# Altium project ESP32_1.PrjPcb
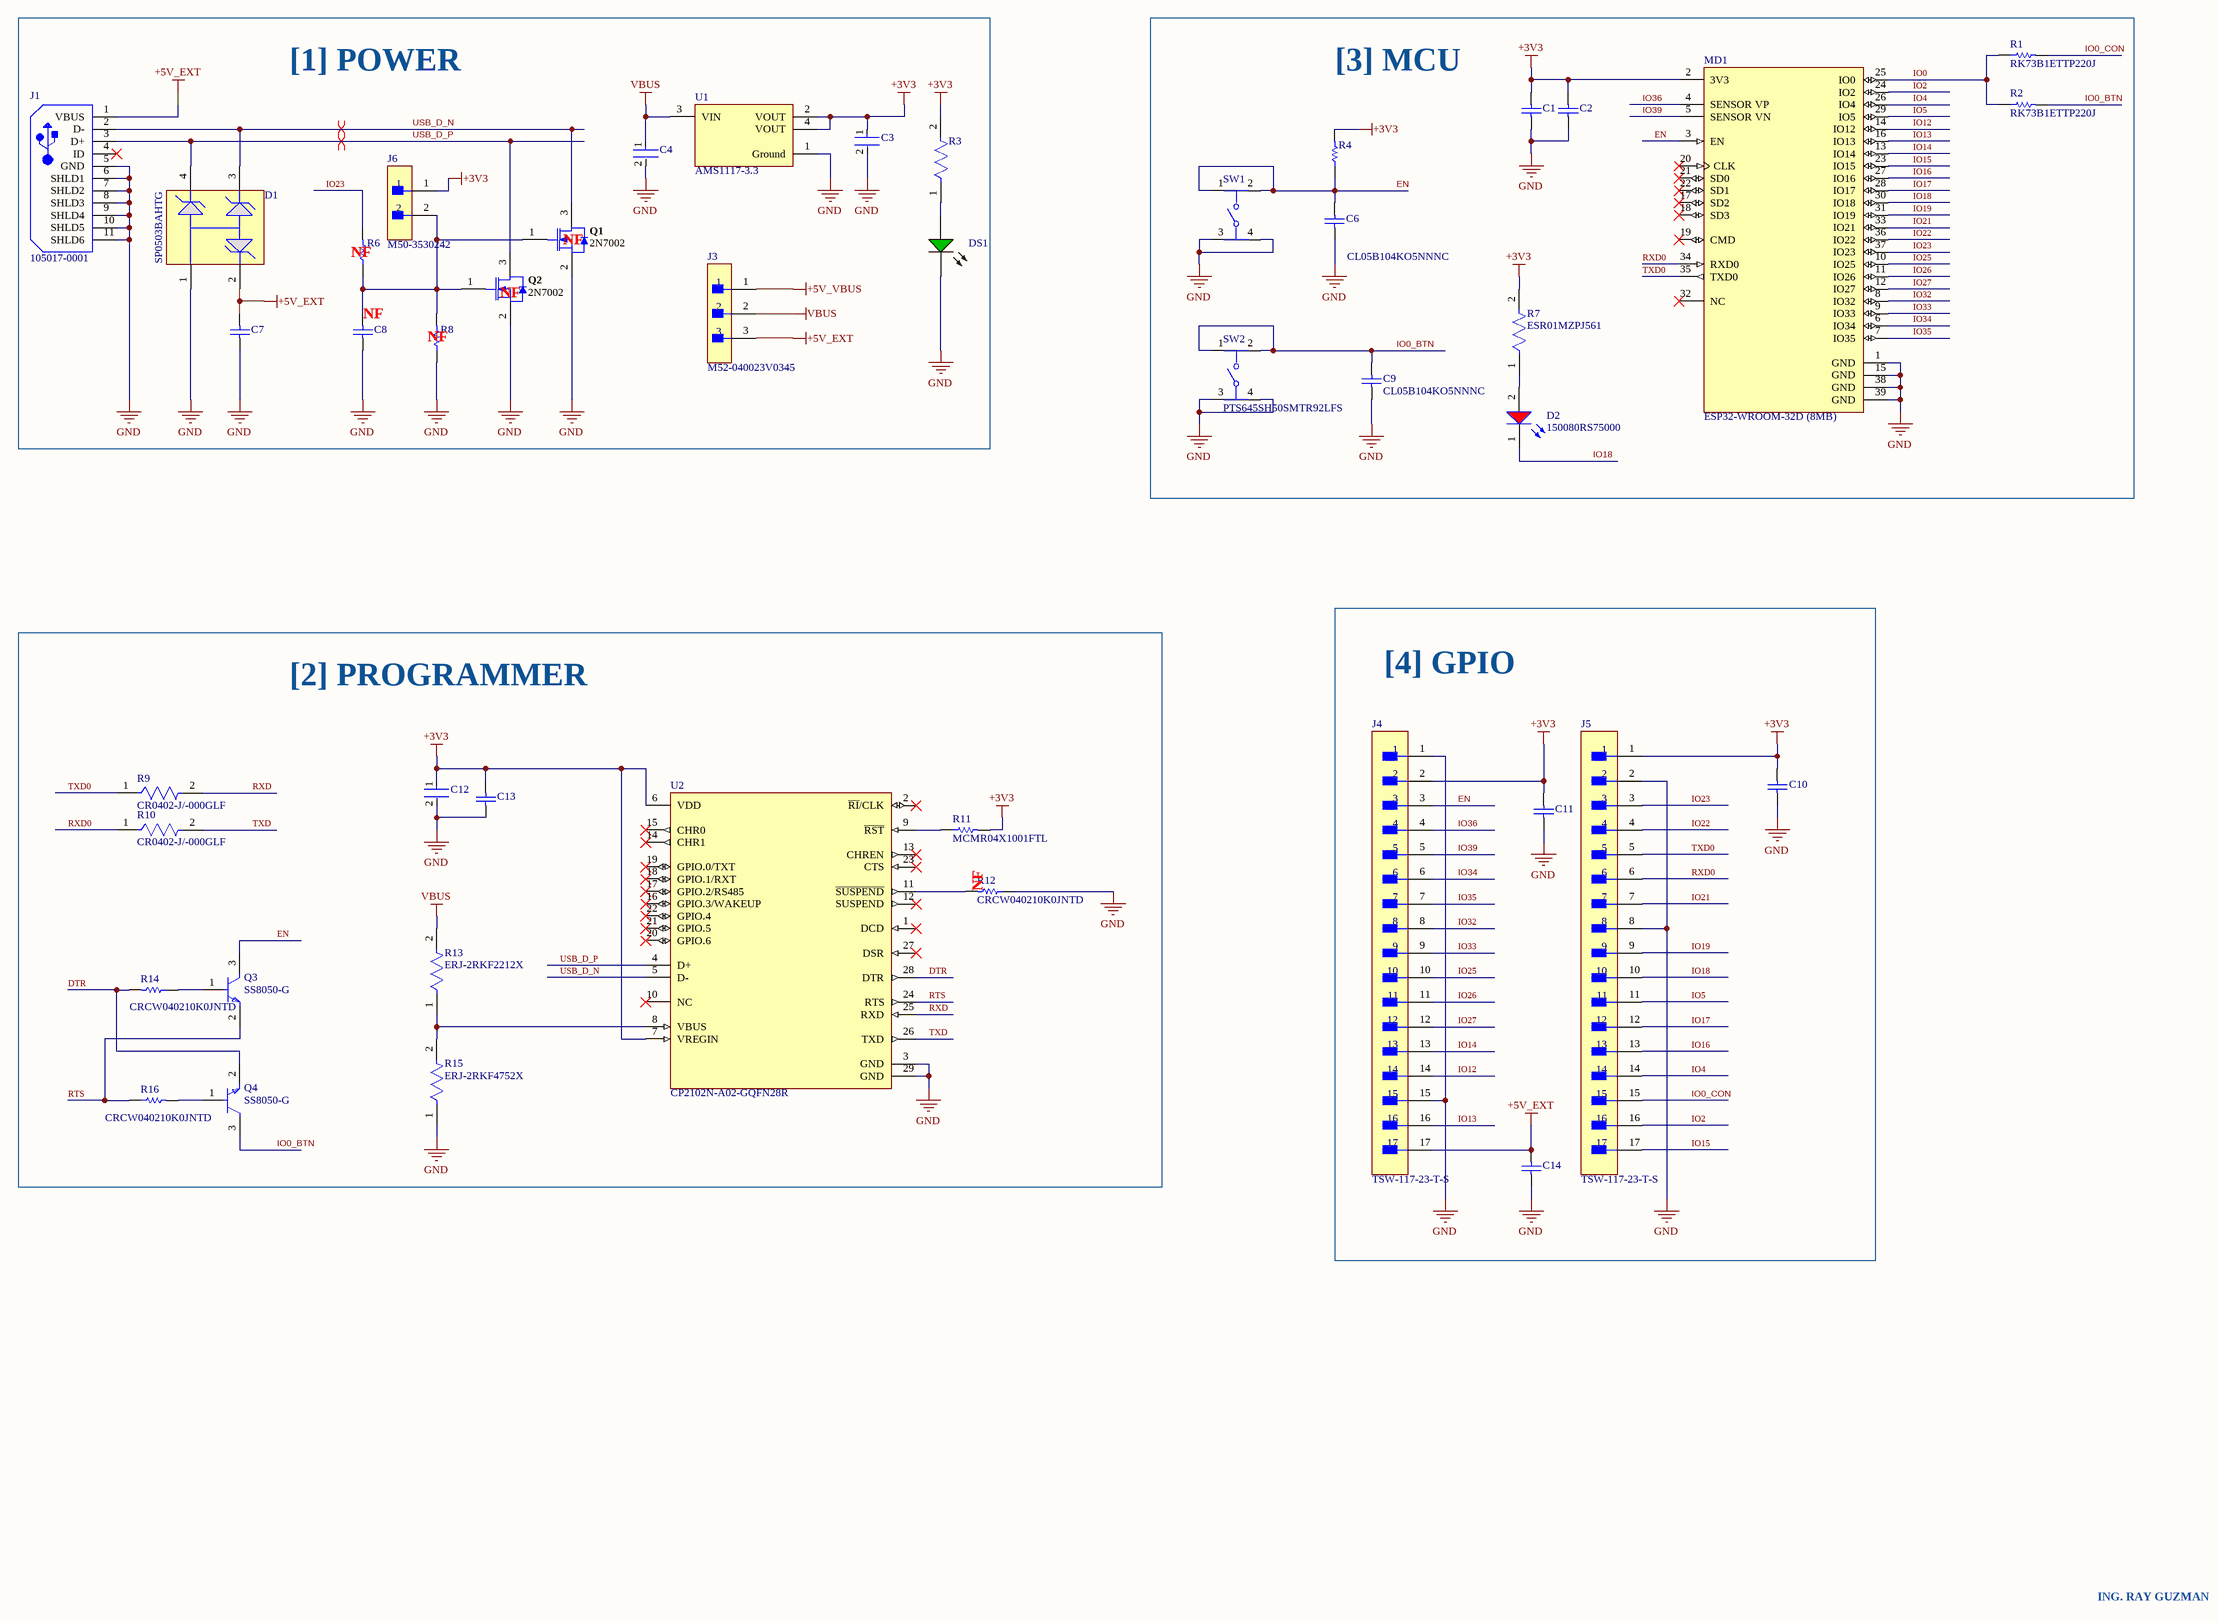
[diagram p0: ESP32_SCH.SchDoc]
1 sheet, 45 parts. Net scope: global (net labels, ports and power ports of the same name join across sheets).
Board file: ESP32_PCB.PcbDoc

## Sheet ESP32_SCH.SchDoc
size C; SheetNumber: 1; SheetTotal: 1

### Parts
C1  CL21A226MAQNNNE  [CAPC2013X140X45LL15T25]  (value not drawn)
C2  CL05B104KO5NNNC  [CAPC1050X55X23ML05T13]  (value not drawn)
C3  CL05A106MP5NUNC  [FP-CL05A106MP5NUNC-MFG]  (value not drawn)
C4  CL05A106MP5NUNC  [FP-CL05A106MP5NUNC-MFG]  (value not drawn)
C6  CL05B104KO5NNNC  [CAPC1050X55X23ML05T13]
C7  CL05B104KO5NNNC  [CAPC1050X55X23ML05T13]  (value not drawn)
C8  CL05B104KO5NNNC  [CAPC1050X55X23ML05T13]  (value not drawn)
C9  CL05B104KO5NNNC  [CAPC1050X55X23ML05T13]
C10  CL05B104KO5NNNC  [CAPC1050X55X23ML05T13]  (value not drawn)
C11  CL05B104KO5NNNC  [CAPC1050X55X23ML05T13]  (value not drawn)
C12  C1005X5R1A475K050BC  [FP-C1005-050-0_15-MFG]  (value not drawn)
C13  CL05B104KO5NNNC  [CAPC1050X55X23ML05T13]  (value not drawn)
C14  CL05B104KO5NNNC  [CAPC1050X55X23ML05T13]  (value not drawn)
D1  SP0503BAHTG  [LFUS-SOT143-4_V]
D2  150080RS75000  [WL-SMCW_0805_150080xx75000]
DS1  HSMG-C170  [AVAG-HSMX-C170_V]  (value not drawn)
J1  105017-0001  [USB-MICRO-B_V]
J3  M52-040023V0345  [FP-M52-040023V0345-MFG]
J4  TSW-117-23-T-S  [FP-TSW-117-23-T-S-MFG]
J5  TSW-117-23-T-S  [FP-TSW-117-23-T-S-MFG]
J6  M50-3530242  [FP-M50-3530242-MFG]
MD1  ESP32-WROOM-32D (8MB)  [FP-ESP32-WROOM-32D_8MB-MFG]
Q1  2N7002  [INF-PG-SOT23_M]
Q2  2N7002  [INF-PG-SOT23_M]
Q3  SS8050-G  [FP-SS8050-G-MFG]
Q4  SS8050-G  [FP-SS8050-G-MFG]
R1  RK73B1ETTP220J  [RESC1005X40X25ML10T10]
R2  RK73B1ETTP220J  [RESC1005X40X25ML10T10]
R3  PNM0402E5001BST1  [FP-PNM0402-IPC_C]  (value not drawn)
R4  CRCW040210K0JNTD  [RESC1005X40X25ML05T05]  (value not drawn)
R6  MCMR04X1001FTL  [RESC1005X40X25ML05T10]  (value not drawn)
R7  ESR01MZPJ561  [FP-ESR01-IPC_C]
R8  CRCW040210K0JNTD  [RESC1005X40X25ML05T05]  (value not drawn)
R9  CR0402-J/-000GLF  [FP-CR0402-IPC_B]
R10  CR0402-J/-000GLF  [FP-CR0402-IPC_B]
R11  MCMR04X1001FTL  [RESC1005X40X25ML05T10]
R12  CRCW040210K0JNTD  [RESC1005X40X25ML05T05]
R13  ERJ-2RKF2212X  [FP-ERJ2RK-IPC_C]
R14  CRCW040210K0JNTD  [RESC1005X40X25ML05T05]
R15  ERJ-2RKF4752X  [FP-ERJ2RK-IPC_A]
R16  CRCW040210K0JNTD  [RESC1005X40X25ML05T05]
SW1  PTS645SH50SMTR92LFS  [FP-PTS645SH50SMTR92LFS-MFG]  (value not drawn)
SW2  PTS645SH50SMTR92LFS  [FP-PTS645SH50SMTR92LFS-MFG]
U1  AMS1117-3.3  [FP-AMS1117-IPC_C]
U2  CP2102N-A02-GQFN28R  [FP-CP2102N-A02-GQFN28R-MFG]

### Blocks framed on the sheet
[1] POWER: C3 C4 C7 C8 D1 DS1 J1 J3 J6 Q1 Q2 R3 R6 R8 U1
[3] MCU: C1 C2 C6 C9 D2 MD1 R1 R2 R4 R7 SW1 SW2
[4] GPIO: C10 C11 C14 J4 J5
[2] PROGRAMMER: C12 C13 Q3 Q4 R9-R16 U2

### Nets
+3V3: C1.1 C2.1 C3.1 C10.1 C11.1 C12.1 C13.1 J4.2 J5.1 J6.1 MD1.2(3V3) R3.2 R4.2 R7.2 R11.2 U1.2(VOUT) U1.4(VOUT) U2.6(VDD) U2.7(VREGIN)
+5V_EXT: C7.1 C14.1 D1.2 J1.1(VBUS) J3.3 J4.17
+5V_VBUS: J3.1
GND: C1.2 C2.2 C3.2 C4.2 C6.1 C7.2 C8.1 C9.1 C10.2 C11.2 C12.2 C13.2 C14.2 D1.1 DS1.2(K) J1.5(GND) J1.6(SHLD1) J1.7(SHLD2) J1.8(SHLD3) J1.9(SHLD4) J1.10(SHLD5) J1.11(SHLD6) J4.1 J4.15 J5.2 J5.8 MD1.1(GND) MD1.15(GND) MD1.38(GND) MD1.39(GND) Q1.2(SOURCE) Q2.2(SOURCE) R8.1 R12.1 R15.1 SW1.3 SW1.4 SW2.3 SW2.4 U1.1(Ground) U2.3(GND) U2.29(GND)
VBUS: C4.1 J3.2 R13.2 U1.3(VIN)
DTR: Q4.2(E) R14.2 U2.28(DTR)
EN: C6.2 J4.3 MD1.3(EN) Q3.3(C) R4.1 SW1.1 SW1.2
IO0: MD1.25(IO0) R1.1 R2.1
IO0_BTN: C9.2 Q4.3(C) R2.2 SW2.1 SW2.2
IO0_CON: J5.15 R1.2
IO2: J5.16 MD1.24(IO2)
IO4: J5.14 MD1.26(IO4)
IO5: J5.11 MD1.29(IO5)
IO12: J4.14 MD1.14(IO12)
IO13: J4.16 MD1.16(IO13)
IO14: J4.13 MD1.13(IO14)
IO15: J5.17 MD1.23(IO15)
IO16: J5.13 MD1.27(IO16)
IO17: J5.12 MD1.28(IO17)
IO18: D2.1(K) J5.10 MD1.30(IO18)
IO19: J5.9 MD1.31(IO19)
IO21: J5.7 MD1.33(IO21)
IO22: J5.4 MD1.36(IO22)
IO23: J5.3 MD1.37(IO23) R6.2
IO25: J4.10 MD1.10(IO25)
IO26: J4.11 MD1.11(IO26)
IO27: J4.12 MD1.12(IO27)
IO32: J4.8 MD1.8(IO32)
IO33: J4.9 MD1.9(IO33)
IO34: J4.6 MD1.6(IO34)
IO35: J4.7 MD1.7(IO35)
IO36: J4.4 MD1.4(SENSOR_VP)
IO39: J4.5 MD1.5(SENSOR_VN)
RTS: Q3.2(E) R16.1 U2.24(RTS)
RXD: R9.2 U2.25(RXD)
RXD0: J5.6 MD1.34(RXD0) R10.1
TXD: R10.2 U2.26(TXD)
TXD0: J5.5 MD1.35(TXD0) R9.1
USB_D_N: D1.3 J1.2(D-) Q1.3(DRAIN) U2.5(D-)
USB_D_P: D1.4 J1.3(D+) Q2.3(DRAIN) U2.4(D+)
NetC8_2: C8.2 J6.2 Q1.1(GATE) Q2.1(GATE) R6.1 R8.2
NetD2_2: D2.2(A) R7.1
NetDS1_1: DS1.1(A) R3.1
NetQ3_1: Q3.1(B) R14.1
NetQ4_1: Q4.1(B) R16.2
NetR11_1: R11.1 U2.9(~{RST})
NetR12_2: R12.2 U2.11(~{SUSPEND})
NetR13_1: R13.1 R15.2 U2.8(VBUS)

Not connected (* = marked no-connect by the designer): J1 4(ID)*; MD1 17(SD2)* 18(SD3)* 19(CMD)* 20(CLK)* 21(SD0)* 22(SD1)* 32(NC)*; U2 1(DCD)* 2(~{RI}/CLK)* 10(NC)* 12(SUSPEND)* 13(CHREN)* 14(CHR1)* 15(CHR0)* 16(GPIO.3/WAKEUP)* 17(GPIO.2/RS485)* 18(GPIO.1/RXT)* 19(GPIO.0/TXT)* 20(GPIO.6)* 21(GPIO.5)* 22(GPIO.4)* 23(CTS)* 27(DSR)*

### Layout directives
differential pair; differential pair class USB_D: USB_D_N, USB_D_P

### Notes on the sheet
- (near R6) NF
- (near J6) NF
- (near Q1) NF
- (near C8) NF
- (near Q2) NF
- (near R8) NF
- (near R12) NF
- ING. RAY GUZMAN

### Library data of the parts
C1 = CMP-2000-06104-1: Multi-layer Ceramic Capacitor, 22 uF, -55 to 85 degC, 2-Pin SMD (0805), RoHS, Tape and Reel; Manufacturer: Samsung Electro-Mechanics; Voltage - Rated: 25V; Other Names: 1276-2908-2; Capacitance: 22µF; Featured Product: Multi-LayerCeramicCapacitors; Product Training Modules: HighCapMLCCFamily; Temperature Coefficient: X5R; Tolerance: ±20%; Online Catalog: CLSeries,HighCapacitance; Applications: GeneralPurpose; RoHS Information: MLCCRoHS2Compliance; Height - Seated (Max): -; Lead Style: -; Lead Spacing: -; Datasheet URL: http://datasheet.octopart.com/CL21A226MAQNNNE-Samsung-datasheet-48647558.pdf; Size / Dimension: 0.079"Lx0.049"W(2.00mmx1.25mm); Thickness (Max): 0.055"(1.40mm); Family: CeramicCapacitors; Package Description: 2-Pin Surface Mount Device, Body 2.0 x 1.25 mm; Datasheet Version: 07/2015; Packaging: Tape&Reel(TR); Manufacturer URL: http://www.samsungsem.com/global/index.jsp; Ratings: -; Package / Case: 0805(2012Metric); Standard Package: 2,000; Mounting Type: SurfaceMount,MLCC; Mounting Technology: SurfaceMount; Category: Capacitors; Package Reference: 0805; Series: CL; Features: -; Operating Temperature: -55°C~85°C
C2 C6-C11 C13 C14 = CMP-2000-05439-1: Chip Capacitor, 100 nF, +/- 10%, 16 V, -55 to 125 degC, 0402 (1005 Metric), RoHS, Tape and Reel; Manufacturer: Samsung Electro-Mechanics; Capacitance: 100000pF; Dielectric: X7R; Rated Voltage: 16V; Case Size/Dimension: 0402; Tolerance (%): ±10%; Manufacturer URL: http://www.samsungsem.com/global/index.jsp; Datasheet URL: https://datasheet.ciiva.com/29198/458718-da-01-en-vs-kondensator-0402-29198423.pdf; Datasheet Version: Nov-10
C3 C4 = CMP-13271-000002-1: CAP CER 10UF 10V X5R 0402; Manufacturer: Samsung; Temperature Coefficient: 15%; Tolerance: 20%; Material: Ceramic; Octopart: https://octopart.com/cl05a106mp5nunc-samsung-22457395; Voltage Rating: 10V; RoHS: TRUE; Value: 10uF; Height: 0.7mm; Digikey Description: CAP CER 10UF 10V X5R 0402; Automotive: No; Package: CL05A106MP5NUNC; Device Class L1: Passive Components; Capacitance: 10uF; Temperature Range High: +85°C; ComponentLink2Description: Datasheet; Device Class L2: Capacitors; Temperature Characteristic: X5R; Manufacturer Part Number: CL05A106MP5NUNC; Temperature: -55°C to +85°C; ComponentLink2URL: http://www.samsungsem.com/kr/support/product-search/mlcc/__icsFiles/afieldfile/2019/05/10/19-CL05A106MP5NUNC.pdf; Device Class L3: Ceramic Capacitors; Category: Cap; Temperature Range Low: -55°C; Ipc Land Pattern Name: CAPC10050X50; Lead Free: Yes
C12 = CMP-2000-05997-2: CAP CER 4.7UF 10V X5R 0402; Dielectric Material: Ceramic; Tolerance: 10%; Series: C; Package Quantity: 10000; Max Operating Temperature: 85°C; Case Code (Imperial): 0402; Lead Free: Lead Free; Voltage Rating (DC): 10V; Packaging: Cut Tape; Voltage Rating: 10V; Min Operating Temperature: -55°C; Dielectric: X5R; Thickness: 0.022inch; Width: 0.02inch; Case/Package: 0402; Case Code (Metric): 1005; Capacitance: 4.7uF; Length: 0.039inch; RoHS Compliant: Yes; REACH SVHC: No SVHC; Mount: Surface Mount
D1 = CMP-2000-05191-1: TVS Diode Array, 30 pF, 30 KV, -40 to 85 degC, 4-Pin SOT143, RoHS, Tape and Reel; Manufacturer: Littelfuse; Direction Type: Uni-Directional; Product Height (mm): 1.05mm; Leakage Current (Max): 0.1uA; Clamping Voltage (Max): 8V; Reverse Stand-off Voltage: 5.5(Min)V; Configuration: Triple; Working Voltage: 5.5V; Product Length (mm): 3.04mm; Working Voltage (Max): 5.5V(Min); Capacitance Value: 30pF; Rad Hardened: No; Number of Elements: 3; Product Depth (mm): 1.4mm; Operating Temperature Max Deg. C: 85C; Suppressor Type: TVS; Operating Temperature Min Deg. C: -40C; Operating Temp Range: -40Cto85C; Mounting: SurfaceMount; Package / Case: SOT-143; Datasheet Version: Dec-13; Package Type: SOT-143; Packaging: TapeandReel; Pin Count: 3+Tab; Operating Temperature Classification: Industrial; Datasheet URL: https://datasheet.ciiva.com/15143/getdatasheetpartid-116020-15143550.pdf; Manufacturer URL: http://www.littelfuse.com/; Leakage Current: 0.1uA; Mounting Style: SurfaceMount; Clamping Voltage: 8V; Polarity: Uni-Directional
D2 = CMP-1426-00011-2: NexarPartId: 29717781; Peak Wavelength: 630nm; Wavelength: 625nm; Viewing Angle: 140°; Test Current: 20mA; Forward Voltage: 2V; Forward Current: 100mA; Lens Style: Clear, Rectangular; Color: Red; Luminous Intensity: 150mcd; Max Reverse Voltage (DC): 5V; Length: 2mm; Case Code (Imperial): 0805; RoHS: Compliant; Max Operating Temperature: 85°C; Height: 700µm; Packaging: Tape and Reel; Case/Package: 0805; REACH SVHC: Unknown; Dominant Wavelength: 625nm; Min Operating Temperature: -40°C; Case Code (Metric): 2012; Mount: Surface Mount; Width: 1.25mm
DS1 = CMP-2000-05062-1: Chip LED, Green, 2.2 V, -40 to 85 degC, 2-Pin SMD, Pb-Free, Tape and Reel; Manufacturer: Avago; No. of Pins: 2; Peak Wavelength: 570nm; SVHC: NoSVHC(16-Jun-2014); Dominant Wavelength: 572nm; Forward Current If: 20mA; Viewing Angle: 170deg; Lens Shape: Rectangular; PIV Max: 5V; External Width: 1.25mm; LED Type: Standard; External Depth: 0.8mm; Opto Mounting Orientation: Top; Luminous Intensity: 15mcd; Luminous Intensity Min: 4mcd; Forward Voltage VF Max: 2.6V; External Length / Height: 2mm; Bulb Size: 1.25mmx1.4mm; Light Area Height: 1mm; Voltage Vf Typ: 2.2V; Operating Temperature Max: 85degC; Datasheet Version: Oct-08; MSL: MSL2A-4weeks; Peak Forward Current: 20mA; Package Description: 2-Pin Surface Mount Device, Body 2 x 1.25 mm, Height 0.8 mm; Datasheet URL: https://datasheet.ciiva.com/29280/180495-da-01-en-chip-led-hsmg-c170-gelb-gruen-29280971.pdf; Storage Temperature Min: -40degC; LED Colour: Green; Wavelength Typ: 570nm; Mounting Type: SMD; Forward Current If Max: 20mA; Dominant Wavelength Typ: 572nm; LED Mounting: SMD; Operating Temperature Range: -30degCto+85degC; Operating Temperature Min: -30degC; Manufacturer URL: http://www.avagotech.com/; Packaging: CutTape; Luminous Intensity Typ: 15mcd; Package Reference: HSMX-C170; Storage Temperature Max: 85degC; Opto Case Style: SMD; Forward Voltage: 2.2V
J1 = CMP-2000-05827-1: Micro-USB B Receptacle, Right Angle, Bottom Mount, Surface Mount, with Solder Tabs, -30 to 85 degC, 5-Pin USB, RoHS, Tape and Reel; Manufacturer: Molex; Featured Product: Micro-USBConnectorsUSBConnectors; Other Names: WM1399DKR; Package Version: Rev. F, 12/2012; Number of Contacts: 5; Connector Type: USB-microB; Catalog Drawings: 1050170001; 3D Model: 105017-0001.stp; Mating Products: WM17145-ND-CABLEMICROUSBBTOSTDA1.0MWM17147-ND-CABLEMICROUSBBTOSTDA2.0MWM17146-ND-CABLEMICROUSBBTOSTDA1.5M; PCN Assembly/Origin: ResinSupplier21/Oct/2015; Voltage - Max: 30V; Online Catalog: Molex-MicroUSB; Manufacturer URL: http://www.molex.com/; Package Description: 5-Leads USB, Micro B, Body 7.5 x 5 mm, Pitch 0.65 mm; Datasheet URL: http://www.molex.com/elqNow/elqRedir.htm?ref=http://www.molex.com/webdocs/datasheets/pdf/en-us/1050170001_IO_CONNECTORS.pdf; Ingress Protection: -; Datasheet Version: 03/2016; Mounting Type: BoardCutout,SurfaceMount,RightAngle; Circuits: 5; Standard Package: 1; Package Reference: MICRO-B; Package URL: http://www.molex.com/pdm_docs/sd/1050170001_sd.pdf; Category: Connectors,Interconnects; Series: -; RoHS Information: 1050170001CertofCompliance; Features: Shielded,SolderRetention; Family: USB,DVI,HDMIConnectors; Specifications: -; Gender: Receptacle; Packaging: Digi-Reel®; Mounting Technology: SurfaceMount
J3 = CMP-15831-000093-1: CONN HEADER VERT 3POS 1.27MM; Case/Package: SIL; RoHS Compliant: No
J4 J5 = CMP-02766-001472-1: CONN HEADER VERT 17POS 2.54MM; Number of Positions: 17; Connector Type: Male Pin; Pitch: 0.1inch; Gender: Male; Lead Free: Lead Free; Housing Color: Black; Termination: Solder; Number of Contacts: 17; Number of Rows: 1; Contact Plating: Tin; Contact Material: Bronze; Width: 2.54mm; Housing Material: Plastic; Length: 43.2mm; Height: 2.54mm; Contact Type: Male Pin; Contact Mating Length: 0.23inch; Color: Black; REACH SVHC: No SVHC; Packaging: Bulk; Mount: Through Hole; RoHS Compliant: Yes; Series: TSW; Package Quantity: 1
J6 = CMP-15831-000040-1: CONN HEADER VERT 2POS 1.27MM
MD1 = CMP-194065-000011-1: RX TXRX MOD WIFI TRACE ANT SMD; Interface: I2C; Memory Size: 536KB; Sensitivity: -98dBm; Frequency: 2.5GHz; Data Rate: 150Mbps; Max Operating Temperature: 85°C; Mount: Surface Mount; Case/Package: SMD/SMT; Packaging: Tape and Reel; Min Operating Temperature: -40°C
Q1 Q2 = CMP-1149-00026-1: N-Channel OptiMOS Small-Signal-Transistor, 60 V VDS, 0.3 A ID, -55 to 150 degC, PG-SOT23, Reel, Green; Manufacturer: Infineon; RDS (on) (max) (@4.5V): 4,000 mOhm; VDS (max): 60 V; IDpuls (max): 1.2Â A; QG: 0.4Â nC; RDS (on) (max): 3,000 mOhm; RthJA (max): 250 K/W; ID (max): 0.3Â A; VGS(th) (max): 2.5Â V; VGS(th) (min): 1.5Â V; Green: TRUE; Ptot (max): 0.5Â W; PackageDescription: 3-Pin Small Outline Transistor Package, 2.9 x 1.3 mm Body, 0.95 mm Pitch; Halogen-free: TRUE; ComponentLink2Description: Datasheet; ComponentLink1URL: http://www.infineon.com/; Packing: Reel; DatasheetVersion: Rev. 2.4; PartNumber: 2N7002; PackageReference: PG-SOT23; PackageVersion: Apr-08; ComponentLink3URL: http://www.infineon.com/dgdl/SOT23-Package_Overview.pdf?folderId=db3a30431936bc4b0119532290053c66&fileId=db3a30431936bc4b0119533468123c85; ComponentLink1Description: Manufacturer URL; Mounting Technology: Surface Mount; ComponentLink3Description: Package Specification; ComponentLink2URL: http://www.infineon.com/dgdl/2N7002_Rev2.4.pdf?folderId=db3a3043156fd573011622e10b5c1f67&fileId=db3a304319bc939a0119c2a9461e79e6
Q3 Q4 = CMP-20235-000001-1: NPN TRANSISTOR 1.5A 40V SOT-23 R; Transition Frequency: 100MHz; Max Breakdown Voltage: 25V; Collector Emitter Voltage (VCEO): 400mV; Max Power Dissipation: 300mW; Max Collector Current: 1.5A; Case/Package: TO-236-3; Packaging: Tape and Reel; RoHS Compliant: Yes; Mount: Surface Mount; Collector Emitter Breakdown Voltage: 25V
R1 R2 = CMP-2002-03643-1: Manufacturer: KOA Speer; Part Number: RK73B1ETTP220J
R3 = CMP-02407-012302-1: RES SMD 5K OHM 0.1% 1/20W 0402; Temperature Coefficient: 25ppm/°C; Resistance: 5kR; Max Power Dissipation: 50mW; Width: 0.022inch; Height: 0.033inch; Tolerance: 0.1%; Number of Terminations: 2; Packaging: Tape and Reel; RoHS Compliant: Yes; Case Code (Imperial): 0402; Min Operating Temperature: -55°C; Case Code (Metric): 1005; Features: Moisture Resistant; Max Operating Temperature: 155°C; Package Quantity: 1000; Resistor Type: Thin Film; Length: 0.042inch; Case/Package: 0402
R4 R8 R12 R14 R16 = CMP-2002-00391-1: Manufacturer: Vishay Dale; Part Number: CRCW040210K0JNTD
R6 R11 = CMP-2002-06478-1: Manufacturer: Multicomp; Part Number: MCMR04X1001FTL
R7 = CMP-08839-007364-1: 560Ω ±5% 0.2W 0402 Anti-Surge Chip Resistor AEC-Q200; Resistance: 560R; Max Power Dissipation: 200mW; Temperature Coefficient: 200ppm/°C; Resistor Type: Thick Film; Series: ESR; Features: Automotive AEC-Q200; Min Operating Temperature: -55°C; Lead Free: Lead Free; Case Code (Imperial): 0402; Max Operating Temperature: 155°C; Case/Package: 0402; Packaging: Cut Tape; Width: 0.02inch; Length: 0.039inch; Tolerance: 5%; Number of Terminations: 2; RoHS Compliant: Yes; Height: 0.016inch; Case Code (Metric): 1005; Package Quantity: 1
R9 R10 = CMP-2002-05495-2: Thick Film Chip Resistors 0402 0Ω 0.0625W 5%; Voltage Rating (DC): 50V; Max Power Dissipation: 63mW; Temperature Coefficient: 500ppm/°C; Resistance: 0mR; Power Rating: 62.5mW; Depth: 0.5mm; Packaging: Tape and Reel; REACH SVHC: No SVHC; Max Operating Temperature: 125°C; Case Code (Metric): 1005; Case Code (Imperial): 0402; Case/Package: 0402; Number of Pins: 2; Thickness: 356um; Composition: Thick Film; Voltage Rating: 50V; Min Operating Temperature: -55°C; Tolerance: 5%; Radiation Hardening: No; Height: 0.35mm; Termination: SMD/SMT; Width: 0.5mm; Mount: Surface Mount; Package Quantity: 10000; Contact Plating: Tin; Length: 1mm
R13 = CMP-1011-00660-3: RES SMD 22.1K OHM 1% 1/10W 0402; Max Power Dissipation: 100mW; Temperature Coefficient: 100ppm/°C; Voltage Rating (DC): 50V; Resistance: 22.1kR; Features: Automotive AEC-Q200; Case Code (Imperial): 0402; Mount: Surface Mount; Min Operating Temperature: -55°C; Package Quantity: 1; Radiation Hardening: No; Case/Package: 0402; Max Operating Temperature: 155°C; Tolerance: 1%; Series: ERJ; Size Code: 0402; RoHS Compliant: Yes; Packaging: Tape and Reel; Contact Plating: Tin; Depth: 0.5mm; Lead Free: Lead Free; REACH SVHC: No SVHC; Length: 1mm; Height: 0.35mm; Number of Terminations: 2; Technology: THICK FILM; Termination: SMD/SMT; Case Code (Metric): 1005; Construction: Rectangular; Width: 0.02inch; Power Rating: 100mW; Voltage Rating: 50V; Military Standard: Not; Resistor Type: Thick Film; Resistance Tolerance: 1%
R15 = CMP-2002-00957-2: RES SMD 47.5K OHM 1% 1/10W 0402; Voltage Rating: 50V; Max Power Dissipation: 100mW; Temperature Coefficient: 100ppm/°C; Resistance: 47.5kR; Packaging: Tape and Reel; Height: 0.35mm; Resistor Type: Thick Film; Width: 0.02inch; Case Code (Imperial): 0402; Voltage Rating (DC): 50V; Package Quantity: 1; Construction: Rectangular; Termination: SMD/SMT; Min Operating Temperature: -55°C; Case Code (Metric): 1005; Features: Automotive AEC-Q200; Length: 1mm; Number of Terminations: 2; Resistance Tolerance: 1%; Power Rating: 100mW; Size Code: 0402; Contact Plating: Tin; RoHS Compliant: Yes; REACH SVHC: No SVHC; Max Operating Temperature: 155°C; Depth: 0.5mm; Technology: THICK FILM; Tolerance: 1%; Mount: Surface Mount; Series: ERJ; Military Standard: Not; Lead Free: Lead Free; Case/Package: 0402
SW1 SW2 = CMP-10040-000028-1: SWITCH TACTILE SPST-NO 0.05A 12V; Operating Force: 200gf; Current Rating: 50mA; Illumination Type: Non-Illuminated; Actuator Material: Nylon; Throw Configuration: SPST; Switch Function: Off-Mom; Mechanical Life: 100000Cycles; Actuator Type: Standard; Packaging: Tape and Reel; Termination: Gull Wing; Max Operating Temperature: 60°C; Length: 6mm; REACH SVHC: No SVHC; Orientation: Straight; Max Voltage Rating (DC): 12V; Package Quantity: 1000; Max Current Rating: 50mA; Mount: Surface Mount; Contact Material: Bronze; Case/Package: SMD/SMT; Lead Free: Lead Free; Min Operating Temperature: -20°C; Contact Plating: Silver; Color: Black; Depth: 9mm; Voltage Rating (DC): 12V
U1 = CMP-209535-000001-1: LDO Voltage Regulators 1A, 3.3V; Manufacturer: Advanced Monolithic Systems; Dropout Voltage: 1.1V; Output Type: Fixed; Nominal Supply Current: 5mA; Max Power Dissipation: 1.2W; Max Supply Voltage: 15V; Number Of Outputs: 1; Standoff Height: 0.64mm; Max Junction Temp: +125°C; Height: 1.8mm; Package: AMS1117; Device Class L2: Power Management ICs; ComponentLink2Description: Datasheet; ComponentLink2URL: http://www.advanced-monolithic.com/pdf/ds1117.pdf; Category: IC; RoHS: TRUE; Automotive: No; Device Class L1: Integrated Circuits (ICs); Output Current: 1A; Device Class L3: Voltage Regulators - Linear; Temperature: -40°C to +125°C; Output Voltage: 3.3V; Manufacturer Part Number: AMS1117-3.3; Temperature Range Low: -40°C; Octopart: https://octopart.com/ams1117-3.3-advanced+monolithic+systems-25899300; Lead Free: Yes; Ipc Land Pattern Name: SOT229P700X180-4; Temperature Range High: +125°C
U2 = CMP-08093-000007-1: IC USB TO UART BRIDGE QFN28